# Altium schematic sheet cpld,cam.SchDoc
size A3; SheetNumber: 7; SheetTotal: 9
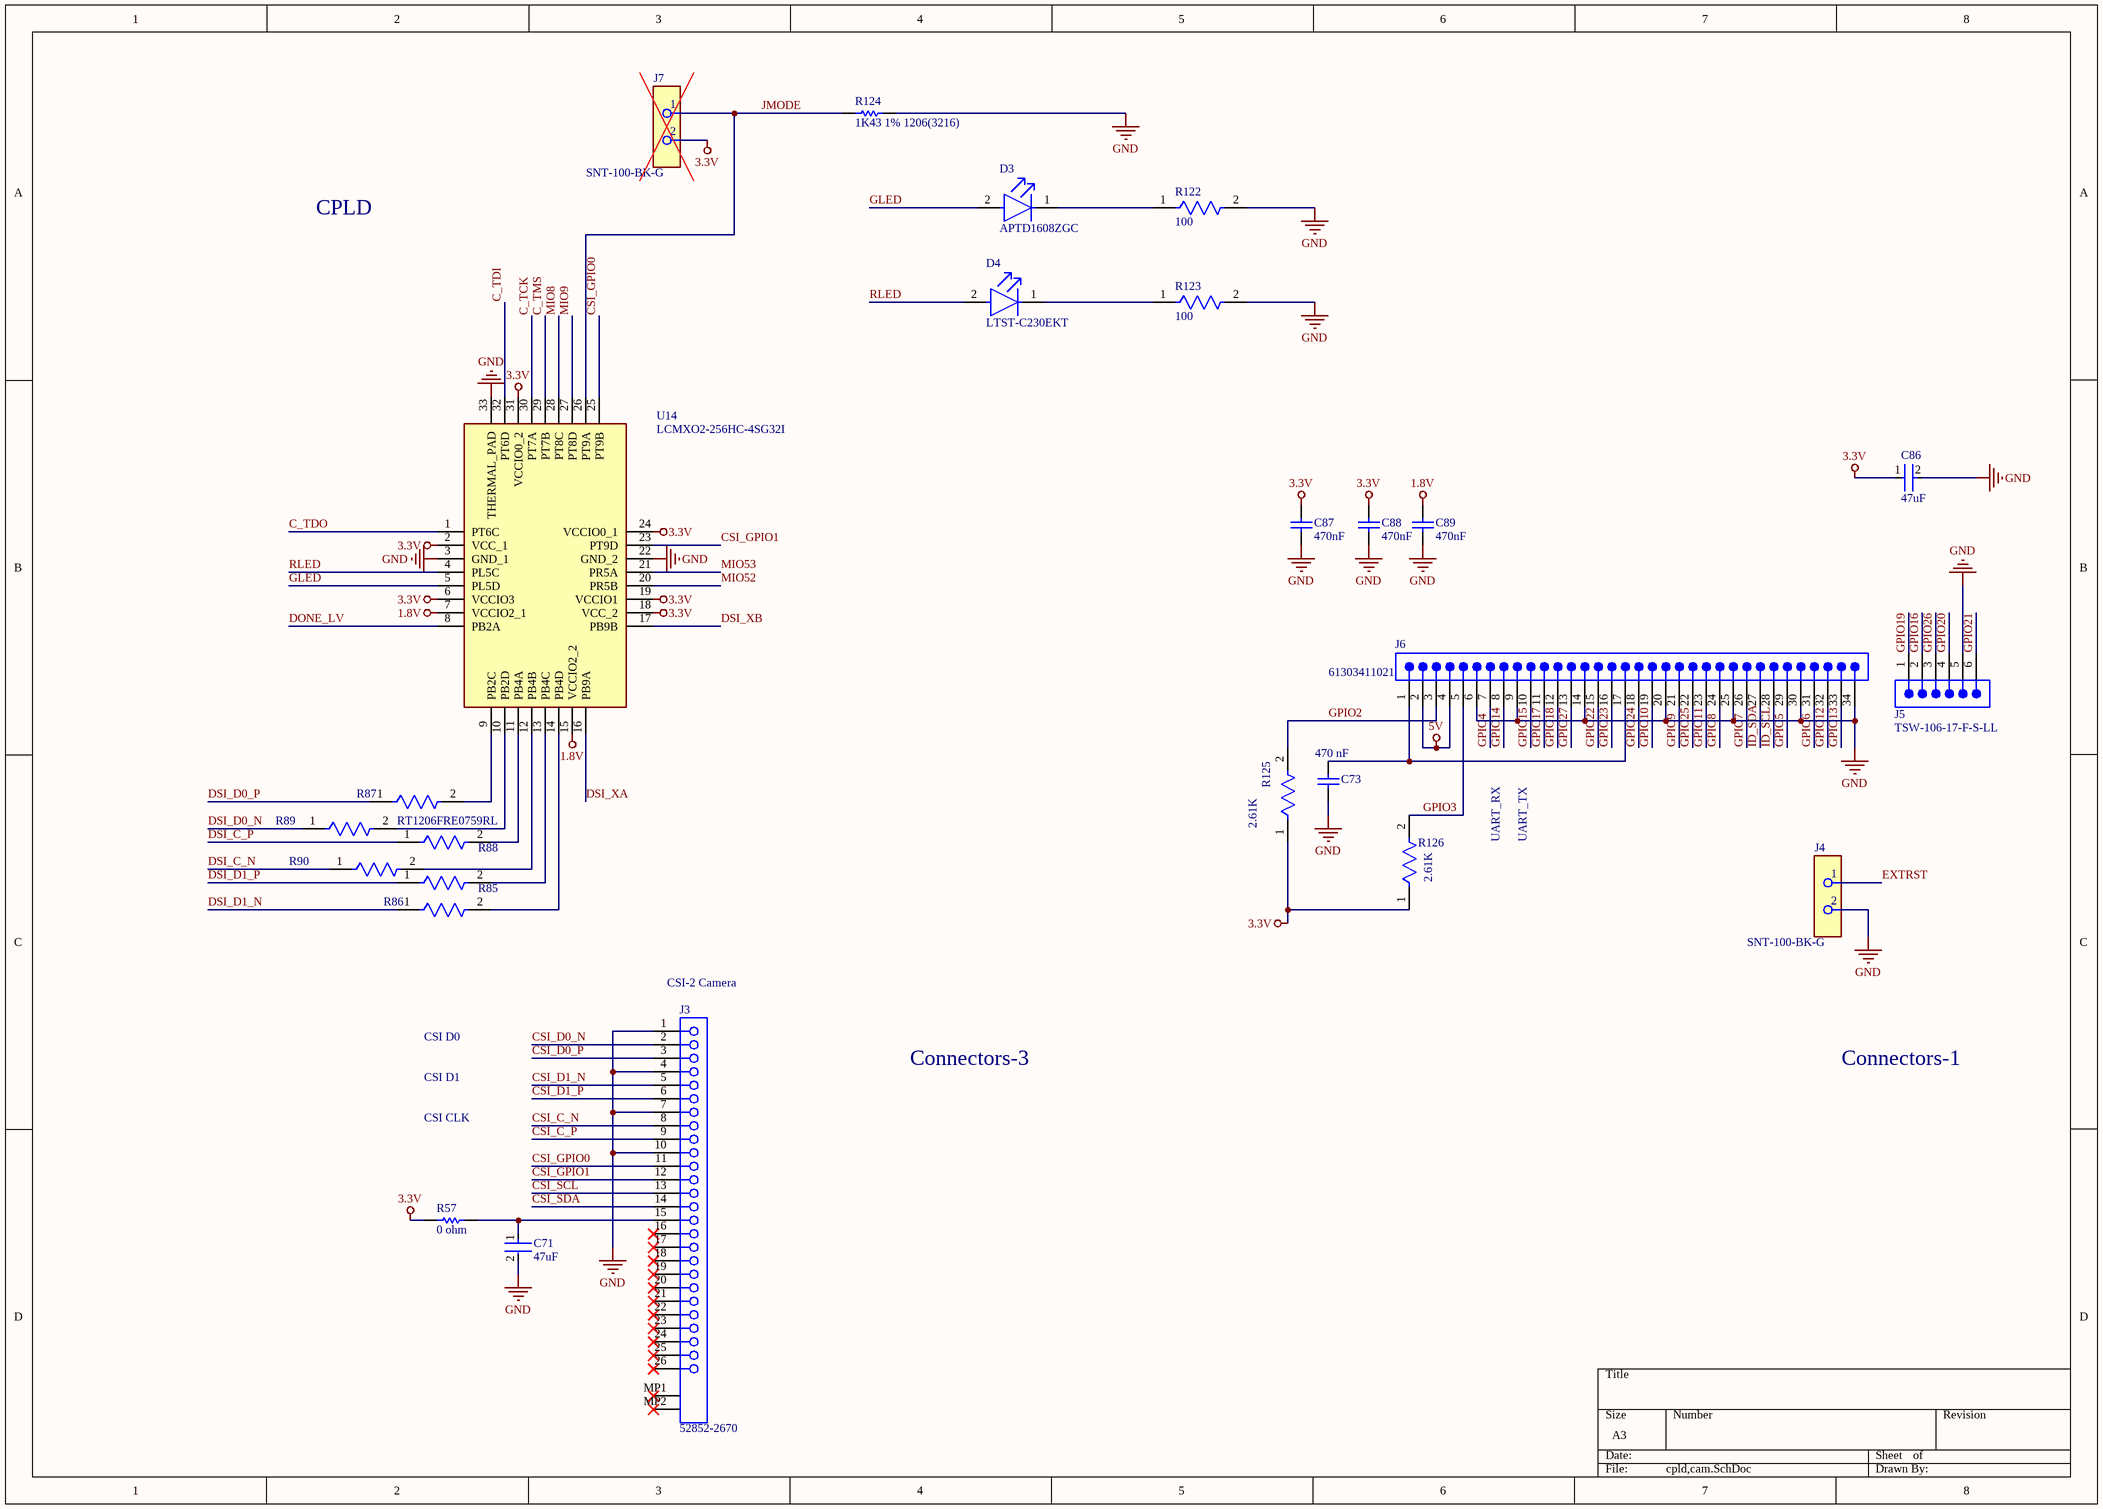
[diagram p0: cpld,cam.SchDoc]

## Parts
C71  47uF  [FP-GRM188-0_2-IPC_C]
C73  470 nF  [CAPC2013X140X50ML20T25]
C86  47uF  [FP-GRM31C-0_3-e0_3_0_8-IPC_C]
C87  470nF  [CAPC2013X140X50ML20T25]
C88  470nF  [CAPC2013X140X50ML20T25]
C89  470nF  [CAPC2013X140X50ML20T25]
D3  APTD1608ZGC  [FP-APTD1608ZGC-MFG]
D4  LTST-C230EKT  [FP-LTST-C230EKT-MFG]
J3  52852-2670  [MOLX-52852-2670]
J4  SNT-100-BK-G  [FP-SNT-100-BK-G-MFG]  (no BOM)
J5  TSW-106-17-F-S-LL  [SMTC-TSW-106-17-X-S-LL]
J6  61303411021  [61303411021]
J7  SNT-100-BK-G  [FP-SNT-100-BK-G-MFG]  (no BOM)
R57  0 ohm  [RESC3225X70X50LL20T20]
R85  RT1206FRE0759RL  [FP-RT1206-MFG]  (value not drawn)
R86  RT1206FRE0759RL  [FP-RT1206-MFG]  (value not drawn)
R87  RT1206FRE0759RL  [FP-RT1206-MFG]
R88  RT1206FRE0759RL  [FP-RT1206-MFG]  (value not drawn)
R89  RT1206FRE0759RL  [FP-RT1206-MFG]  (value not drawn)
R90  RT1206FRE0759RL  [FP-RT1206-MFG]  (value not drawn)
R122  100  [FP-RMCF0805-IPC_A]
R123  100  [FP-RMCF0805-IPC_A]
R124  1K43 1% 1206(3216)  [RESC1206(3216)_M]
R125  2.61K  [FP-RK73H1J-IPC_B]
R126  2.61K  [FP-RK73H1J-IPC_B]
U14  LCMXO2-256HC-4SG32I  [QFN50P500X500X60-33N]

## Nets
1.8V: C89.2 U14.7(VCCIO2_1) U14.15(VCCIO2_2)
3.3V: C86.1 C87.2 C88.2 R57.1 R125.1 R126.1 U14.2(VCC_1) U14.6(VCCIO3) U14.18(VCC_2) U14.19(VCCIO1) U14.24(VCCIO0_1) U14.31(VCCIO0_2)
5V: J6.2 J6.4
GND: C71.2 C73.1 C86.2 C87.1 C88.1 C89.1 J3.1 J3.4 J3.7 J3.10 J5.5 J6.6 J6.9 J6.14 J6.20 J6.25 J6.30 J6.34 R122.2 R123.2 R124.2 U14.3(GND_1) U14.22(GND_2) U14.33(THERMAL_PAD)
C_TCK: U14.30(PT7A)
C_TDI: U14.32(PT6D)
C_TDO: U14.1(PT6C)
C_TMS: U14.29(PT7B)
CSI_C_N: J3.8
CSI_C_P: J3.9
CSI_D0_N: J3.2
CSI_D0_P: J3.3
CSI_D1_N: J3.5
CSI_D1_P: J3.6
CSI_GPIO0: J3.11 U14.25(PT9B)
CSI_GPIO1: J3.12 U14.23(PT9D)
CSI_SCL: J3.13
CSI_SDA: J3.14
DONE_LV: U14.8(PB2A)
DSI_C_N: R90.1
DSI_C_P: R88.1
DSI_D0_N: R89.1
DSI_D0_P: R87.1
DSI_D1_N: R86.1
DSI_D1_P: R85.1
DSI_XA: U14.16(PB9A)
DSI_XB: U14.17(PB9B)
GLED: D3.2(A) U14.5(PL5D)
GPIO2: J6.3 R125.2
GPIO3: J6.5 R126.2
GPIO4: J6.7
GPIO5: J6.29
GPIO6: J6.31
GPIO7: J6.26
GPIO8: J6.24
GPIO9: J6.21
GPIO10: J6.19
GPIO11: J6.23
GPIO12: J6.32
GPIO13: J6.33
GPIO14: J6.8
GPIO15: J6.10
GPIO16: J5.2
GPIO17: J6.11
GPIO18: J6.12
GPIO19: J5.1
GPIO20: J5.4
GPIO21: J5.6
GPIO22: J6.15
GPIO23: J6.16
GPIO24: J6.18
GPIO25: J6.22
GPIO26: J5.3
GPIO27: J6.13
ID_SCL: J6.28
ID_SDA: J6.27
JMODE: R124.1 U14.26(PT9A)
MIO8: U14.28(PT8C)
MIO9: U14.27(PT8D)
MIO52: U14.20(PR5B)
MIO53: U14.21(PR5A)
RLED: D4.2(A) U14.4(PL5C)
NetC71_1: C71.1 J3.15 R57.2
NetC73_2: C73.2 J6.1 J6.17
NetD3_1: D3.1(C) R122.1
NetD4_1: D4.1(C) R123.1
NetR85_2: R85.2 U14.13(PB4C)
NetR86_2: R86.2 U14.14(PB4D)
NetR87_2: R87.2 U14.9(PB2C)
NetR88_2: R88.2 U14.11(PB4A)
NetR89_2: R89.2 U14.10(PB2D)
NetR90_2: R90.2 U14.12(PB4B)

Not connected (* = marked no-connect by the designer): J3 16* 17* 18* 19* 20* 21* 22* 23* 24* 25* 26* MP1* MP2*

## Notes on the sheet
- CPLD
- UART_RX
- UART_TX
- (near J3) CSI-2 Camera
- CSI D0
- CSI D1
- CSI CLK
- Connectors-3
- Connectors-1

## Library data of the parts
C71 = CMP-06035-022085-1: Chip Multilayer Ceramic Capacitors for General Purpose, 0603, 47uF, X5R, 15%, 20%, 4V
C73 C87-C89 = CMP-2007-04634-1: Manufacturer: AVX Interconnect / Elco; Part Number: 08055C474JAT2A
C86 = CMP-06035-011430-1: Chip Multilayer Ceramic Capacitors for General Purpose, 1206, 47uF, X5R, 15%, 20%, 16V; Capacitance: 47uF; Length: 3.2mm; Thickness: 1.6mm; Width: 1.6mm; Voltage Rating (DC): 16V; Tolerance: 20%; Dielectric: X5R
D3 = CMP-44529-000047-1: LED GREEN CLEAR CHIP SMD; Forward Current: 20mA; Viewing Angle: 60°; Dominant Wavelength: 525nm; Luminous Intensity: 780mcd; Forward Voltage: 3.3V; Lens Style: Clear; Max Operating Temperature: 85°C; Case/Package: 0603; Illumination Color: Green; Mount: Surface Mount; Case Code (Imperial): 0603; Case Code (Metric): 1608; Min Operating Temperature: -40°C; Length: 1.6mm; Color: Green; Lead Free: Lead Free; Width: 0.8mm; Package Quantity: 2000; Height: 0.95mm; Packaging: Tape and Reel; Test Current: 20mA
D4 = CMP-22017-000030-1: LED RED CLEAR CHIP SMD; Forward Current: 30mA; Test Current: 10mA; Number of Elements: 1; Viewing Angle: 130°; Dominant Wavelength: 621nm; Forward Voltage: 2V; Lens Style: Diffused; Power Rating: 100mW; Reverse Voltage: 5V; Wavelength: 630nm; Luminous Intensity: 6mcd; Lens Color: Colorless; Case/Package: 1206; Case Code (Imperial): 1206; Package Quantity: 1; Lead Free: Lead Free; Case Code (Metric): 3216; Height: 1.1mm; Lens Transparency: Clear; Mount: Surface Mount; Depth: 1.6mm; Number of LEDs: 1; Power Dissipation: 100mW; Max Operating Temperature: 85°C; Width: 1.6mm; Color: Red; Number of Pins: 2; Min Operating Temperature: -55°C; Packaging: Tape and Reel; Radiation Hardening: No; Illumination Color: Red; Length: 3.2mm
J3 = CMP-1241-00458-1: 1.0 mm Pitch Easy-On(TM) Type FFC Connector, 3.1 mm Mated Height, Right Angle, Non-ZIF, SMT, Bottom Contact, 26 Circuits, -20 to 80 degC, ELV and RoHS Compliant, Tape and Reel; Manufacturer: Molex; Entry Angle: 90degrees Angle; Material - Plating Termination: Tin-Bismuth; Mated Height: 3.10mm; Circuits (maximum): 26; PCB Locator: No; Pitch - Mating Interface: 1.00mm; Current (Max per Contact): 0.5A; Voltage (Max): 50V AC (RMS)/DC; PCB Retention: Yes; Material - Metal: Phosphor Bronze; Durability (mating cycles max): 10; ComponentLink3Description: Package Specification; Material - Plating Mating: Tin-Bismuth; Orientation: Right Angle; ComponentLink2Description: Datasheet; Mounting Technology: Surface Mount; Packing: Tape and Reel; PackageDescription: 26-Lead FFC Connector, Pitch 1.0 mm; PackageVersion: Rev. A, 11/2004; PackageReference: 52852-2670; PartNumber: 52852-2670; Number of Rows: 1; Stackable: No; Polarized to PCB: No; Contact Position: Bottom; Pitch - Termination Interface: 1.00mm; ComponentLink2URL: http://www.molex.com/webdocs/datasheets/pdf/en-us/0528522670_FFC_FPC_CONNECTORS.pdf; ComponentLink1Description: Manufacturer URL; RoHS: TRUE; Circuits (Loaded): 26; ComponentLink1URL: http://www.molex.com/molex/index.jsp; ComponentLink3URL: http://www.molex.com/pdm_docs/sd/528522670_sd.pdf
J4 J7 = CMP-02752-000005-1: CONN SHUNT 2POS; Number of Positions: 2; Max Current Rating: 2.5A; Pitch: 2.54mm; Contact Resistance: 5mR; Min Operating Temperature: -55°C; Number of Rows: 1; Housing Color: Black; Package Quantity: 1; Depth: 2.54mm; Housing Material: Polyester; Series: SNT; RoHS Compliant: Yes; Orientation: Straight; Radiation Hardening: No; Number of Contacts: 2; REACH SVHC: No SVHC; Length: 5.08mm; Contact Plating: Gold; Max Operating Temperature: 125°C; Color: Black; Packaging: Bulk; Height: 0.24inch; Contact Material: Bronze
J5 = CMP-1024-00393-1: 0.025" SQ Post Header, Through-hole, Vertical, -55 to 125 degC, 2.54 mm Pitch, 6-Pin, Male, RoHS; Manufacturer: Samtec; Pitch: 2.54 mm; PackageReference: TSW-106-17-X-S-LL; ComponentLink3Description: Package Specification; PackageVersion: DM, 8/1988; ComponentLink2Description: Datasheet; ComponentLink1URL: http://www.samtec.com; Mounting Technology: Through-hole; ComponentLink3URL: http://www.samtec.com/documents/webfiles/cpdf/TSW-XXX-XX-XXX-X-XX-XXX-MKT.pdf; ComponentLink1Description: Manufacturer URL; RoHS: True; ComponentLink2URL: http://www.samtec.com/documents/webfiles/pdf/TSW_TH.PDF; Orientation: Vertical; Temperature Range: -55 to 125 degC; DatasheetVersion: F-214; PackageDescription: .025[0.64] SQ. Post Terminal Strip Assembly; PartNumber: TSW-106-17-F-S-LL
J6 = CMP-1502-01125-3: NexarPartId: 32855570; Contact Resistance: 20mΩ; Operating Supply Voltage: 250V; Current Rating: 3A; Number of Contacts: 34; Connector Type: Male Pin; Gender: Male; Pitch: 2.54mm; Mount: Through Hole; Contact Material: Copper; Packaging: Bulk; Color: Black; Number of Rows: 1; RoHS: Compliant; Contact Plating: Gold; Lead Pitch: 2.54mm; Number of Pins: 34; Number of Positions: 34; REACH SVHC: Unknown; Contact Mating Length: 5.9944mm; Termination: Solder
R57 = CMP-2005-03785-1: Manufacturer: Panasonic; Part Number: ERJ-S140R00U
R85-R90 = CMP-03412-008110-1: RES SMD 59 OHM 1% 1/4W 1206; Manufacturer: Yageo; Power Rating: 0.25W; Voltage Rating: 200V; Temperature Coefficient: 50 ppm/°C; Value: 59Ω; Tolerance: 0.0002; Temperature Range High: +155°C; Automotive: No; Octopart: https://octopart.com/rt1206fre0759rl-yageo-1483639; Temperature Range Low: -55°C; Manufacturer Part Number: RT1206FRE0759RL; Package: RT1206; Device Class L2: Resistors; Device Class L1: Passive Components; Footprint Url: http://www.yageo.com/exep/pages/download/literatures/PYu-R_Mount_10.pdf; Category: Res; Mouser Description: Thin Film Resistors 1/4W 59 ohm 1% 50ppm; Height: 0.65mm; Digikey Description: RES SMD 59 OHM 1% 1/4W 1206; Series: RT; ComponentLink2Description: Datasheet; Composition: Thin Film; Temperature: -55°C to +155°C; Lead Free: Yes; Ipc Land Pattern Name: RESC310160X55; ComponentLink2URL: http://www.yageo.com/documents/recent/PYu-RT_1-to-0.01_RoHS_L_9.pdf; RoHS: TRUE; Resistance: 59Ω; Device Class L3: Chip SMD Resistors
R122 R123 = CMP-26527-001731-1: 100Ω ±1% 0.125W 0805 Thick Film Chip Resistor AEC-Q200 compliant; Power Rating: 250mW; Temperature Coefficient: 100ppm/°C; Resistance: 100R; Max Power Dissipation: 125mW; Radiation Hardening: No; RoHS Compliant: Yes; Case Code (Imperial): 0805; Depth: 1.25mm; Length: 2mm; Min Operating Temperature: -55°C; Series: RMCF; Packaging: Tape and Reel; Features: Automotive AEC-Q200; Height: 0.026inch; Size Code: 0805; Tolerance: 1%; Number of Terminations: 2; Max Operating Temperature: 155°C; Case/Package: 0805; Width: 0.049inch; Contact Plating: Tin; Resistor Type: Thick Film; Construction: Rectangular; Lead Free: Lead Free; Military Standard: Not; Case Code (Metric): 2012; Mount: Surface Mount
R124 = CMP-1014-00526-1: 1K43 0.25W 1% 1206 (3216 Metric)  SMD; Value: 1430.00 Ohm; Case-EIA: 1206; Case-Metric: 3216; Power: 0.25 W; Technology: SMT; Tolerance: 1 %
R125 R126 = CMP-04015-095862-1: 2.61kΩ ±0.5% 0.1W Chip Resistor 0603 Thick Film AEC-Q200 Qualified
U14 = LCMXO2-256HC-4SG32I: Integrated Circuit; Manufacturer_Name: Lattice Semiconductor; Datasheet Link: https://datasheet.datasheetarchive.com/originals/distributors/Datasheets-DGA19/41708.pdf; Height: 0.6mm; Manufacturer_Part_Number: LCMXO2-256HC-4SG32I; Mouser Part Number: 842-LCXO2256HC4SG32I; Mouser Price/Stock: https://www.mouser.co.uk/ProductDetail/Lattice/LCMXO2-256HC-4SG32I?qs=0pXo3msJWLP4CWqvg3QOuw%3D%3D; Arrow Part Number: LCMXO2-256HC-4SG32I; Arrow Price/Stock: https://www.arrow.com/en/products/lcmxo2-256hc-4sg32i/lattice-semiconductor?region=nac